# Altium project S6_Relay_block.PrjPcb
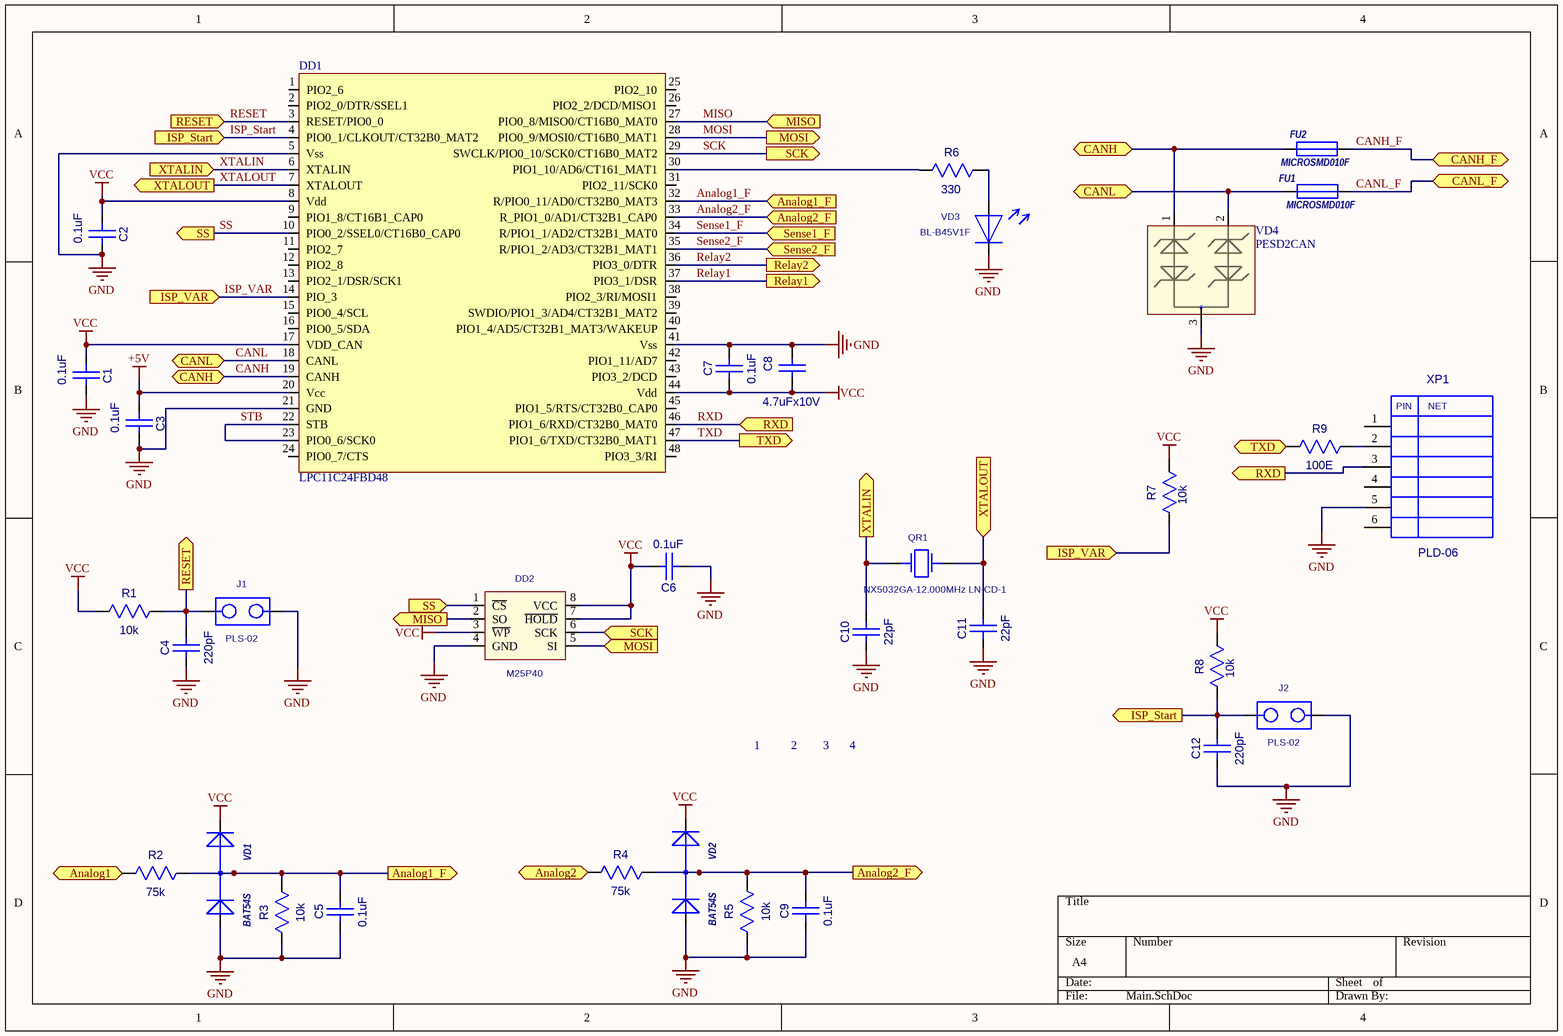
[diagram p0: Main.SchDoc]
3 sheets, 91 parts. Net scope: flat (ports and power ports of the same name join across sheets).
Board file: Relay_CANS6.PcbDoc
Sheets:
  Main.SchDoc
  Output.SchDoc
  Power.SchDoc

## Sheet Main.SchDoc
size A4

### Parts
1  REPER1.2  [REPER1.2]  (value not drawn)
2  REPER1.2  [REPER1.2]  (value not drawn)
3  REPER1.2  [REPER1.2]  (value not drawn)
4  REPER1.2  [REPER1.2]  (value not drawn)
C1  0.1uF  [CC0603-3M]
C2  0.1uF  [CC0603-3M]
C3  0.1uF  [CC0603-3M]
C4  220pF  [CC0603-3M]
C5  0.1uF  [CC0603-3M]
C6  0.1uF  [CC0603-3M]
C7  0.1uF  [CC0603-3M]
C8  4.7uFx10V  [CC0805-MIDI-2M1]
C9  0.1uF  [CC0603-3M]
C10  22pF  [CC0603-3M]
C11  22pF  [CC0603-3M]
C12  220pF  [CC0603-3M]
DD1  LPC11C24FBD48  [LQFP-48]
DD2  M25P40  [EIAJ_SO8]
FU1  MICROSMD010F  [RC1210]
FU2  MICROSMD010F  [RC1210]
J1  PLS-02  [PLS-02]
J2  PLS-02  [PLS-02]
QR1  NX5032GA-12.000MHz LN-CD-1  [AC5032_2]
R1  10k  [RC0603-3M]
R2  75k  [RC0603-3M]
R3  10k  [RC0603-3M]
R4  75k  [RC0603-3M]
R5  10k  [RC0603-3M]
R6  330  [RC0603-3M]
R7  10k  [RC0603-3M]
R8  10k  [RC0603-3M]
R9  100E  [RC0603-3M]
VD1  BAT54S  [SOT-23(GSD)]
VD2  BAT54S  [SOT-23(GSD)]
VD3  BL-B45V1F  [LED3]
VD4  PESD2CAN  [SOT-23(123)]
XP1  PLD-06  [PIN6]

### Ports
Analog1 (in), Analog1_F (in), Analog1_F (out), Analog2 (in), Analog2_F (in), Analog2_F (out), CANH, CANH_F, CANL, CANL_F, ISP_Start (in), ISP_Start (out), ISP_VAR (in), MISO (in), MISO (out), MOSI (in), MOSI (out), Relay1 (out), Relay2 (out), RESET (in), RESET (out), RXD (in), RXD (out), SCK (in), SCK (out), Sense1_F (in), Sense2_F (in), SS (in), SS (out), TXD (in), TXD (out), XTALIN (in), XTALIN (out), XTALOUT (in), XTALOUT (out)

### Nets
+5V: C3.1(A) DD1.20(Vcc)
GND: C1.2(B) C2.2(B) C3.2(B) C4.1(A) C5.1(A) C6.1(A) C7.2(B) C8.2(B) C9.1(A) C10.1(A) C11.1(A) C12.1(A) DD1.5(Vss) DD1.21(GND) DD1.41(Vss) DD2.4(GND) J1.2 J2.2 R3.1(A) R5.1(A) VD1.1(A) VD2.1(A) VD3.1 VD4.3 XP1.5
VCC: C1.1(A) C2.1(A) C6.2(B) C7.1(A) C8.1(A) DD1.8(Vdd) DD1.17(VDD_CAN) DD1.44(Vdd) DD2.3(~{WP}) DD2.7(~{HOLD}) DD2.8(VCC) R1.1(A) R7.2(B) R8.2(B) VD1.2(K) VD2.2(K)
Analog1: R2.1(A) ; port Analog1
Analog1_F: C5.2(B) DD1.32(R/PIO0_11/AD0/CT32B0_MAT3) R2.2(B) R3.2(B) VD1.3(AK) ; port Analog1_F
Analog2: R4.1(A) ; port Analog2
Analog2_F: C9.2(B) DD1.33(R_PIO1_0/AD1/CT32B1_CAP0) R4.2(B) R5.2(B) VD2.3(AK) ; port Analog2_F
CANH: DD1.19(CANH) FU2.1 VD4.1 ; port CANH
CANH_F: FU2.2 ; port CANH_F
CANL: DD1.18(CANL) FU1.1 VD4.2 ; port CANL
CANL_F: FU1.2 ; port CANL_F
ISP_Start: C12.2(B) DD1.4(PIO0_1/CLKOUT/CT32B0_MAT2) J2.1 R8.1(A) ; port ISP_Start
ISP_VAR: DD1.14(PIO_3) R7.1(A) ; port ISP_VAR
MISO: DD1.27(PIO0_8/MISO0/CT16B0_MAT0) DD2.2(SO) ; port MISO
MOSI: DD1.28(PIO0_9/MOSI0/CT16B0_MAT1) DD2.5(SI) ; port MOSI
Relay1: DD1.37(PIO3_1/DSR) ; port Relay1
Relay2: DD1.36(PIO3_0/DTR) ; port Relay2
RESET: C4.2(B) DD1.3(RESET/PIO0_0) J1.1 R1.2(B) ; port RESET
RXD: DD1.46(PIO1_6/RXD/CT32B0_MAT0) XP1.3 ; port RXD
SCK: DD1.29(SWCLK/PIO0_10/SCK0/CT16B0_MAT2) DD2.6(SCK) ; port SCK
Sense1_F: DD1.34(R/PIO1_1/AD2/CT32B1_MAT0) ; port Sense1_F
Sense2_F: DD1.35(R/PIO1_2/AD3/CT32B1_MAT1) ; port Sense2_F
SS: DD1.10(PIO0_2/SSEL0/CT16B0_CAP0) DD2.1(~{CS}) ; port SS
STB: DD1.22(STB) DD1.23(PIO0_6/SCK0)
TXD: DD1.47(PIO1_6/TXD/CT32B0_MAT1) R9.1(A) ; port TXD
XTALIN: C10.2(B) DD1.6(XTALIN) QR1.1 ; port XTALIN
XTALOUT: C11.2(B) DD1.7(XTALOUT) QR1.2 ; port XTALOUT
NetDD1_30: DD1.30(PIO1_10/AD6/CT161_MAT1) R6.1(A)
NetR6_2: R6.2(B) VD3.2
NetR9_2: R9.2(B) XP1.2

Not connected (* = marked no-connect by the designer): 1 1; 2 1; 3 1; 4 1; DD1 1(PIO2_6) 2(PIO2_0/DTR/SSEL1) 9(PIO1_8/CT16B1_CAP0) 11(PIO2_7) 12(PIO2_8) 13(PIO2_1/DSR/SCK1) 15(PIO0_4/SCL) 16(PIO0_5/SDA) 24(PIO0_7/CTS) 25(PIO2_10) 26(PIO2_2/DCD/MISO1) 31(PIO2_11/SCK0) 38(PIO2_3/RI/MOSI1) 39(SWDIO/PIO1_3/AD4/CT32B1_MAT2) 40(PIO1_4/AD5/CT32B1_MAT3/WAKEUP) 42(PIO1_11/AD7) 43(PIO3_2/DCD) 45(PIO1_5/RTS/CT32B0_CAP0) 48(PIO3_3/RI); XP1 1 4 6

### Notes on the sheet
- (in symbol PLD-06) PIN; NET

### Library data of the parts
C1-C7 C9-C12 = CC0603
  C1-C3 C5-C7 C9: Value: 0.1uF
  C4 C12: Value: 220pF
  C10 C11: Value: 22pF
C8 = CC0805: Value: 4.7uFx10V
DD2 = S25FL016A0LMFI01: Value: M25P40
FU1 FU2 = MICROSMD: Value: MICROSMD010F
QR1 = AC5032_2: AC5032/2; Value: NX5032GA-12.000MHz LN-CD-1
R1-R9 = RC0603
  R1 R3 R5 R7 R8: Value: 10k
  R2 R4: Value: 75k
  R6: Value: 330
  R9: Value: 100E
VD1 VD2 = BAT54S: 1.0 Ampere General Purpose Rectifier; ComponentField6: Published 8-Jun-2000, Modified 11-July-2000: SIM Model Added.; Value: *
VD3 = LED_3: Value: *
VD4 = PESD2CAN: TVS for CAN
XP1 = PLD-06: PLD06; Value: *
1-4 = REPER1.2: Value: *
DD1 = LPC11C24FBD48: Value: LPC11C24FBD48
J1 J2 = PLS-02: Value: PLS-02

## Sheet Output.SchDoc
size A4
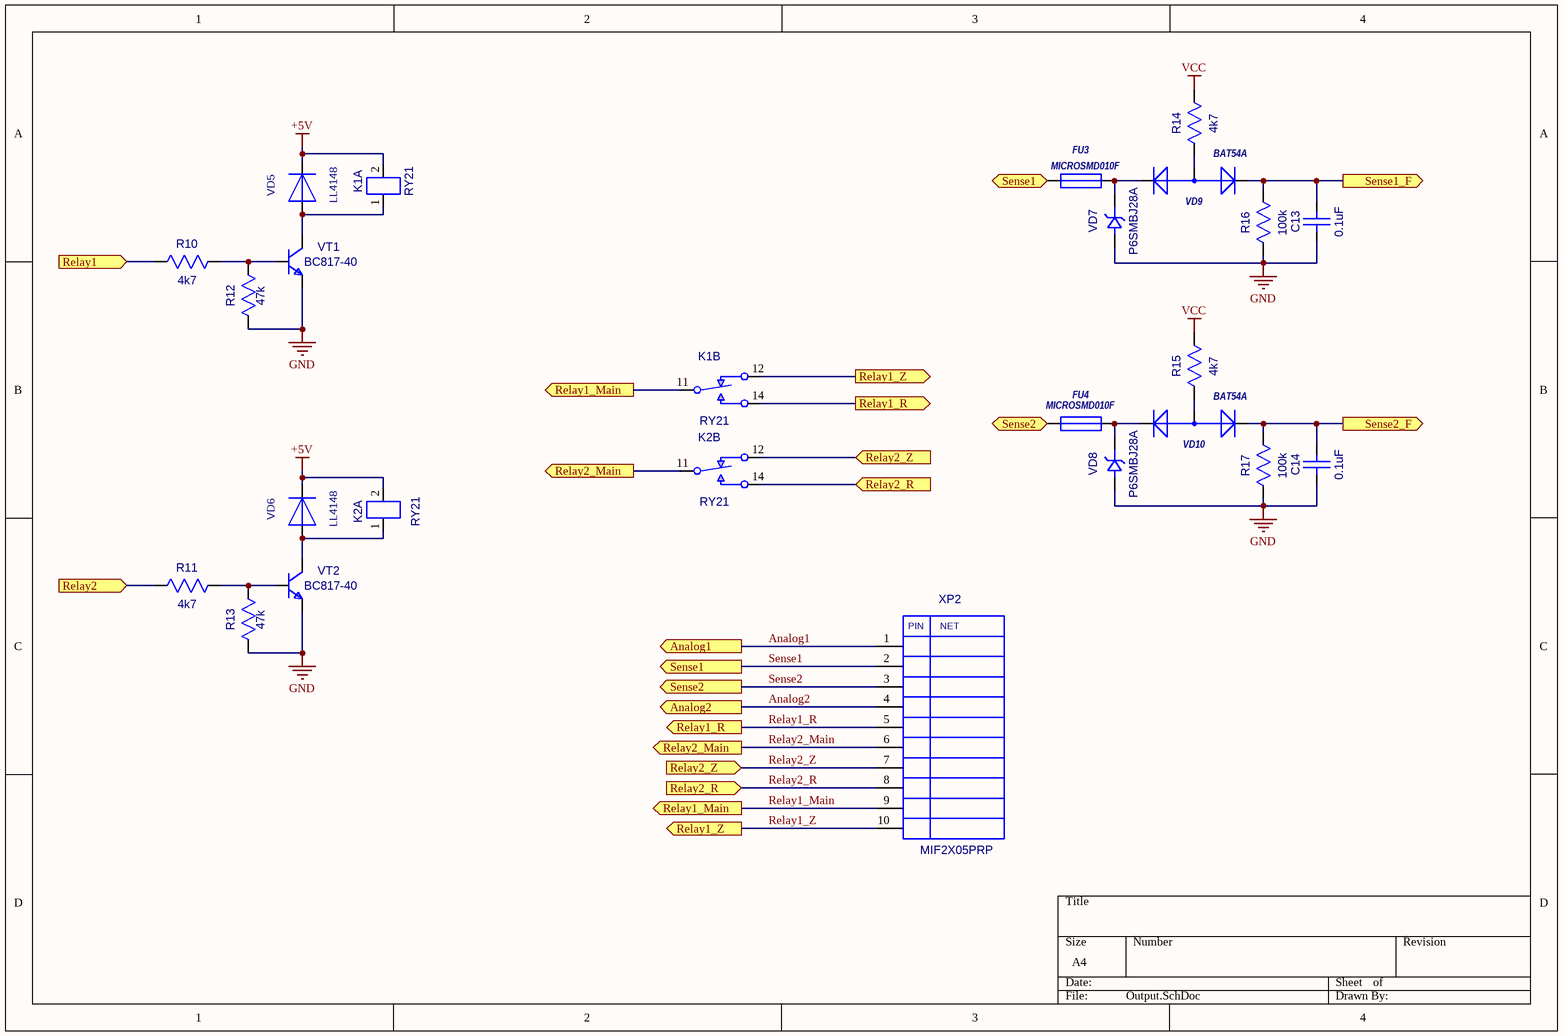
[diagram p1: Output.SchDoc]

### Parts
C13  0.1uF  [CC0603-3M]
C14  0.1uF  [CC0603-3M]
FU3  MICROSMD010F  [RC1210]
FU4  MICROSMD010F  [RC1210]
K1  RY21  [RY21_RY21(Primary)]  (parts A,B of 2)
K2  RY21  [RY21_RY21(Primary)]  (parts A,B of 2)
R10  4k7  [RC0603-3M]
R11  4k7  [RC0603-3M]
R12  47k  [RC0603-3M]
R13  47k  [RC0603-3M]
R14  4k7  [RC0603-3M]
R15  4k7  [RC0603-3M]
R16  100k  [RC0603-3M]
R17  100k  [RC0603-3M]
VD5  LL4148  [SOD-80]
VD6  LL4148  [SOD-80]
VD7  P6SMBJ28A  [SMB]
VD8  P6SMBJ28A  [SMB]
VD9  BAT54A  [SOT-23(123)]
VD10  BAT54A  [SOT-23(123)]
VT1  BC817-40  [SOT-23(123)]
VT2  BC817-40  [SOT-23(123)]
XP2  MIF2X05PRP  [MIF2X05PRP]

### Ports
Analog1 (out), Analog2 (out), Relay1 (in), Relay1_Main (out), Relay1_R (out), Relay1_Z (out), Relay2 (in), Relay2_Main (out), Relay2_R (in), Relay2_Z (in), Sense1 (in), Sense1 (out), Sense1_F (out), Sense2 (in), Sense2 (out), Sense2_F (out)

### Nets
+5V: K1.2(C2) K2.2(C2) VD5.2(+) VD6.2(+)
GND: C13.1(A) C14.1(A) R12.1(A) R13.1(A) R16.1(A) R17.1(A) VD7.1(A) VD8.1(A) VT1.2(E) VT2.2(E)
VCC: R14.2(B) R15.2(B)
Analog1: XP2.1 ; port Analog1
Analog2: XP2.4 ; port Analog2
Relay1: R10.1(A) ; port Relay1
Relay1_Main: K1.11(C1) XP2.9 ; port Relay1_Main
Relay1_R: K1.14(C2) XP2.5 ; port Relay1_R
Relay1_Z: K1.12(C3) XP2.10 ; port Relay1_Z
Relay2: R11.1(A) ; port Relay2
Relay2_Main: K2.11(C1) XP2.6 ; port Relay2_Main
Relay2_R: K2.14(C2) XP2.8 ; port Relay2_R
Relay2_Z: K2.12(C3) XP2.7 ; port Relay2_Z
Sense1: FU3.1 XP2.2 ; port Sense1
Sense1_F: C13.2(B) R16.2(B) VD9.1(K) ; port Sense1_F
Sense2: FU4.1 XP2.3 ; port Sense2
Sense2_F: C14.2(B) R17.2(B) VD10.1(K) ; port Sense2_F
NetFU3_2: FU3.2 VD7.2(K) VD9.2(K)
NetFU4_2: FU4.2 VD8.2(K) VD10.2(K)
NetK1_1: K1.1(L1) VD5.1(-) VT1.3(C)
NetK2_1: K2.1(L1) VD6.1(-) VT2.3(C)
NetR10_2: R10.2(B) R12.2(B) VT1.1(B)
NetR11_2: R11.2(B) R13.2(B) VT2.1(B)
NetR14_1: R14.1(A) VD9.3(A)
NetR15_1: R15.1(A) VD10.3(A)

### Notes on the sheet
- (in symbol MIF2X05PRP) PIN; NET

### Library data of the parts
C13 C14 = CC0603: Value: 0.1uF
FU3 FU4 = MICROSMD: Value: MICROSMD010F
R10-R17 = RC0603
  R10 R11 R14 R15: Value: 4k7
  R12 R13: Value: 47k
  R16 R17: Value: 100k
VD7 VD8 = SMBJ: Value: P6SMBJ28A
VD9 VD10 = BAT54A: 1.0 Ampere General Purpose Rectifier; ComponentField6: Published 8-Jun-2000, Modified 11-July-2000: SIM Model Added.; Value: *
VT1 VT2 = BC846BLT1: Value: {Value}; ComponentField7: Published 29-Sep-2000; OriginalName: BC846BLT1
K1 K2 = RY21: Value: *
VD5 VD6 = LL4148: Value: *
XP2 = MIF2X05PRP: Value: *

## Sheet Power.SchDoc
size A4
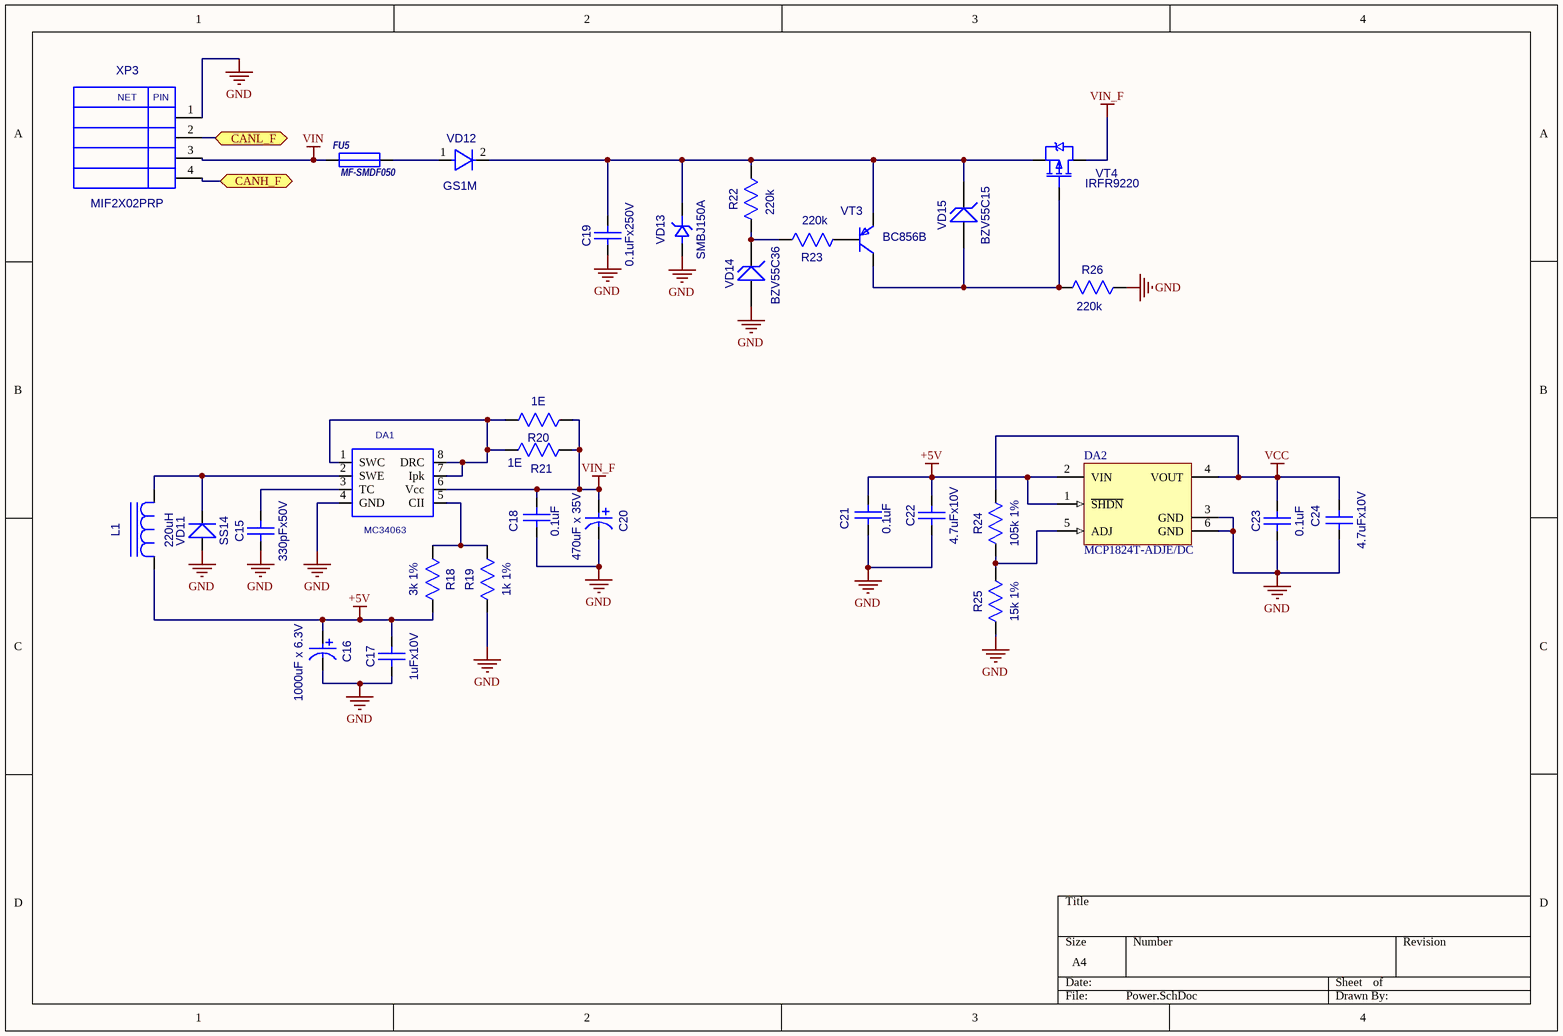
[diagram p2: Power.SchDoc]

### Parts
C15  330pFx50V  [CC0603-3M]
C16  1000uF x 6.3V  [CC8X3.5]
C17  1uFx10V  [CC0603-3M]
C18  0.1uF  [CC0603-3M]
C19  0.1uFx250V  [CC1206-MIDI]
C20  470uF x 35V  [CC16X10_CAP0.5(1)(Primary)]
C21  0.1uF  [CC0603-3M]
C22  4.7uFx10V  [CC0805-MIDI-2M1]
C23  0.1uF  [CC0603-3M]
C24  4.7uFx10V  [CC0805-MIDI-2M1]
DA1  MC34063  [SO-8]
DA2  MCP1824T-ADJE/DC  [SOT223-6]
FU5  MF-SMDF050  [MF-SMDF]
L1  220uH  [SDR0805]
R18  3k 1%  [RC0603-3M]
R19  1k 1%  [RC0603-3M]
R20  1E  [RC0805_IPC_NOM]
R21  1E  [RC0805_IPC_NOM]
R22  220k  [RC1206-2M]
R23  220k  [RC1206-2M]
R24  105k 1%  [RC0603-3M]
R25  15k 1%  [RC0603-3M]
R26  220k  [RC1206-2M]
VD11  SS14  [SMA]
VD12  GS1M  [SMA]
VD13  SMBJ150A  [SMB]
VD14  BZV55C36  [SOD-80]
VD15  BZV55C15  [SOD-80]
VT3  BC856B  [SOT-23(123)]
VT4  IRFR9220  [D-PAK(TO-252AA)]
XP3  MIF2X02PRP  [MIF2X02PRP]

### Ports
CANH_F, CANL_F

### Nets
+5V: C16.1 C17.2(B) C21.1(A) C22.2(B) DA2.1(~{SHDN}) DA2.2(VIN) L1.1(C) R18.2(B)
GND: C15.1(A) C16.2 C17.1(A) C18.2(B) C19.1(A) C20.1 C21.2(B) C22.1(A) C23.1(A) C24.1(A) DA1.4(GND) DA2.3(GND) DA2.6(GND) R19.1(A) R25.1(A) R26.2(B) VD11.1(A) VD13.1(A) VD14.1(A) XP3.1
VCC: C23.2(B) C24.2(B) DA2.4(VOUT) R24.2(B)
VIN: FU5.1 XP3.3
VIN_F: C18.1(A) C20.2 DA1.6(Vcc) R20.1(A) R21.1(A) VT4.3(D)
CANH_F: XP3.4 ; port CANH_F
CANL_F: XP3.2 ; port CANL_F
NetC15_2: C15.2(B) DA1.3(TC)
NetC19_2: C19.2(B) R22.2(B) VD12.2(K) VD13.2(K) VD15.2 VT3.2(E) VT4.2(S)
NetDA1_1: DA1.1(SWC) DA1.7(Ipk) DA1.8(DRC) R20.2(B) R21.2(B)
NetDA1_2: DA1.2(SWE) L1.2(A) VD11.2(K)
NetDA1_5: DA1.5(CII) R18.1(A) R19.2(B)
NetDA2_5: DA2.5(ADJ) R24.1(A) R25.2(B)
NetFU5_2: FU5.2 VD12.1(A)
NetR22_1: R22.1(A) R23.2(B) VD14.2
NetR23_1: R23.1(A) VT3.1(B)
NetR26_1: R26.1(A) VD15.1(A) VT3.3(C) VT4.1(G)

### Notes on the sheet
- (in symbol MIF2X02PRP) NET; PIN

### Library data of the parts
C15 C17 C18 C21 C23 = CC0603
  C15: Value: 330pFx50V
  C17: Value: 1uFx10V
  C18 C21 C23: Value: 0.1uF
C16 = CAP0.35: Value: 1000uF x 6.3V
C19 = CC1206: Value: 0.1uFx250V
C20 = CAP0.5(1): Value: 470uF x 35V
C22 C24 = CC0805: Value: 4.7uFx10V
DA2 = MCP1824T-ADJE/DC: 300 mA, Low Voltage, Low Quiescent Current LDO Regulator, 5-Pin SOT-223, Extended Temperature, Tape and Reel; Published: 29-Jan-2009; DatasheetVersion: revA, Aug-2007; PackageVersion: revAW, Oct-2008; PackageReference: SOT-223-DC5; Publisher: Altium Limited; PackageDescription: 5-Lead Plastic Small Outline Transistor (DC) [SOT-223]; ComponentLink1Description: Manufacturer Link; ComponentLink1URL: http://www.microchip.com; ComponentLink2Description: Datasheet; ComponentLink2URL: http://ww1.microchip.com/downloads/en/DeviceDoc/22070a.pdf; ComponentLink3Description: Packaging Specification; ComponentLink3URL: http://ww1.microchip.com/downloads/en/PackagingSpec/00049AW.pdf
FU5 = MF-SMDF: Value: MF-SMDF050
L1 = SDR0805: Value: 220uH
R18 R19 R24 R25 = RC0603
  R18: Value: 3k 1%
  R19: Value: 1k 1%
  R24: Value: 105k 1%
  R25: Value: 15k 1%
R20 R21 = RC0805: Value: 1E
R22 R23 R26 = RC1206: Value: 220k
VD11 = SS14: Schottky Rectifier; Value: SS14
VD12 = GS1M: Value: {Value}
VD13 = SMBJ: Value: SMBJ150A
VD14 VD15 = BZV55C12: Zener Voltage Regulator Diode; OriginalName: BZX84C10LT1; ComponentField6: Pin 2 is not connected and not drawn.; ComponentField7: Published 29-Sep-2000
  VD14: Value: BZV55C36
  VD15: Value: BZV55C15
VT3 = BC856B: OriginalName: BC856BLT; ComponentField7: Published 29-Sep-2000; Value: BC856B
VT4 = IRFR9220: HEXFET Power MOSFET; OriginalName: IRLML5103; ComponentField7: Published 8-Jun-2000; Value: IRFR9220
DA1 = MC34063: Value: *
XP3 = MIF2X02PRP: Value: *

## Nets that join several sheets
+5V: Main (C3.1 DD1.20), Output (K1.2 K2.2 VD5.2 VD6.2), Power (8 pins)
GND: Main (25 pins), Output (10 pins), Power (20 pins)
VCC: Main (16 pins), Output (R14.2 R15.2), Power (C23.2 C24.2 DA2.4 R24.2)
Analog1: Main (R2.1), Output (XP2.1)
Analog2: Main (R4.1), Output (XP2.4)
CANH_F: Main (FU2.2), Power (XP3.4)
CANL_F: Main (FU1.2), Power (XP3.2)
Relay1: Main (DD1.37), Output (R10.1)
Relay2: Main (DD1.36), Output (R11.1)
Sense1_F: Main (DD1.34), Output (C13.2 R16.2 VD9.1)
Sense2_F: Main (DD1.35), Output (C14.2 R17.2 VD10.1)